# Altium schematic sheet radio.SchDoc: Fault-Tolerant Quadcopter
size A; DrawnBy: Vaughn Kottler; Engineer: Vaughn Kottler; Revision: A
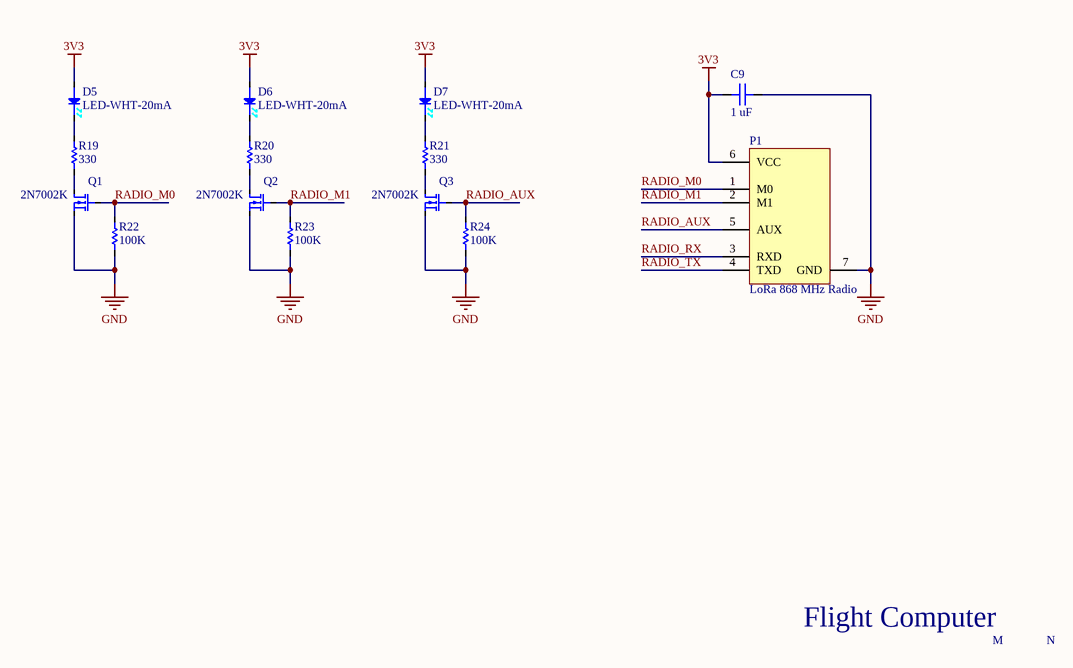
[diagram p0: radio.SchDoc]

## Parts
C9  1 uF  [CAP-CER-0805-TALL]
D5  LED-WHT-20mA  [LED-0805]
D6  LED-WHT-20mA  [LED-0805]
D7  LED-WHT-20mA  [LED-0805]
P1  LoRa 868 MHz Radio  [LoRa Breakout]
Q1  2N7002K  [SC-89]
Q2  2N7002K  [SC-89]
Q3  2N7002K  [SC-89]
R19  330  [RES-0805]
R20  330  [RES-0805]
R21  330  [RES-0805]
R22  100K  [RES-0805]
R23  100K  [RES-0805]
R24  100K  [RES-0805]

## Nets
3V3: C9.1 D5.1(CT) D6.1(CT) D7.1(CT) P1.6(VCC)
GND: C9.2 P1.7(GND) Q1.2(S) Q2.2(S) Q3.2(S) R22.1 R23.1 R24.1
RADIO_AUX: P1.5(AUX) Q3.1(G) R24.2
RADIO_M0: P1.1(M0) Q1.1(G) R22.2
RADIO_M1: P1.2(M1) Q2.1(G) R23.2
RADIO_RX: P1.3(RXD)
RADIO_TX: P1.4(TXD)
NetD5_2: D5.2(AN) R19.2
NetD6_2: D6.2(AN) R20.2
NetD7_2: D7.2(AN) R21.2
NetQ1_3: Q1.3(D) R19.1
NetQ2_3: Q2.3(D) R20.1
NetQ3_3: Q3.3(D) R21.1

## Notes on the sheet
- Flight Computer
- M
- N

## Library data of the parts
C9 = CAP-CER-1uF-10V: ±10%, 0805; ComponentLink1Description: Capacitor Book (Amazon); ComponentLink1URL: https://www.amazon.com/gp/product/B0728HBDRW/
D5-D7 = LED-WHT-20mA: 2.2V, 0805; ComponentLink1Description: Resistor Book (Amazon); ComponentLink1URL: https://www.amazon.com/gp/product/B071J21FYF/; Supplier 1: Digi-Key; Supplier Part Number 1: 475-1410-1-ND
P1 = 868 MHz SX1276 LoRa Breakout: UART Interface, 0.1" Pitch, E32 (868T20D) chipset; ComponentLink1Description: Amazon; ComponentLink1URL: https://www.amazon.com/gp/product/B07GPLJTWD/
Q1-Q3 = NMOS-2.0VT-60VDS-300mA: N-Channel, SOT-23; ComponentLink1Description: Datasheet; ComponentLink1URL: https://www.rohm.com/datasheet/RE1C002UN/re1c002untcl-e; Supplier 1: Digi-Key; Supplier Part Number 1: 2N7002K-T1-E3DKR-ND
R19-R21 = RES-330-1/8W: 0805; ComponentLink1Description: Resistor Book (Amazon); ComponentLink1URL: https://www.amazon.com/gp/product/B071J21FYF/
R22-R24 = RES-100K-1/8W: 0805; ComponentLink1Description: Resistor Book (Amazon); ComponentLink1URL: https://www.amazon.com/gp/product/B071J21FYF/